# Altium schematic sheet Battery Circuit.SchDoc: STM32 LoRa Node
size A4; Author: Leon Baždar; CompanyName: FER; Address1: Zagreb; Revision: V1.0; SheetNumber: 3; SheetTotal: 6
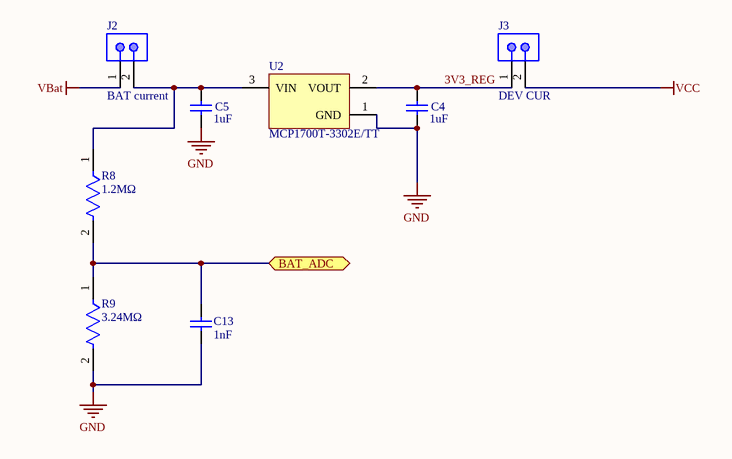
[diagram p0: Battery Circuit.SchDoc]

## Parts
C4  1uF  [CAPC2013X145X50LL20T25]
C5  1uF  [CAPC2013X145X50LL20T25]
C13  1nF  [CAPC1005X55X25LL05T05]
J2  BAT current  [TECO-5-146280-2_V]
J3  DEV CUR  [TECO-5-146280-2_V]
R8  1.2MΩ  [FP-CRCW0603-e3-IPC_A]
R9  3.24MΩ  [FP-CRCW0603-e3-MFG]
U2  MCP1700T-3302E/TT  [SOT-23-TT3_N]

## Ports
BAT_ADC (bidir)

## Nets
GND: C4.2 C5.2 C13.1 R9.2 U2.1(GND)
VBat: J2.1
VCC: J3.2
3V3_REG: C4.1 J3.1 U2.2(VOUT)
BAT_ADC: C13.2 R8.2 R9.1 ; port BAT_ADC
NetC5_1: C5.1 J2.2 R8.1 U2.3(VIN)

## Notes on the sheet
- Project:
- File:
- Size:
- A4
- Author:
- Revision:
- Date:
- Sheet
- of

## Library data of the parts
C4 C5 = CMP-2007-01016-1: Manufacturer: Kemet; Part Number: C0805C105K4PACTU
C13 = CMP-2008-01229-1: Manufacturer: Vitramon; Part Number: VJ0402Y102KXXCW1BC
J2 J3 = CMP-2000-07492-1: Male Header, Pitch 2.54 mm, 1 x 2 Position, Height 8.21 mm, Tail Length 3.05 mm, -65 to 105 degC, RoHS, Bulk; Manufacturer: TE Connectivity; Mating Connector Lock: No(Without); Number of Positions: 2; Pitch: 2.54mm; PCB Mounting Orientation: Vertical; Keyed: No; Case\/Package: 100; Mating Post Length: 0.23inch; High Temperature Housing: Yes; Max Current Rating: 5A; PCB Thickness: 0.063inch; PCB Mount Retention: Without; Approvals: CSA; Current Rating: 3A; Radiation Hardening: No; Length: 4.67mm; Contact Mating Length: 0.23inch; Connector Type: Header; Number of Rows: 1; Termination Post Length: 0.12inch; Board Standoff: No(Without); Max Operating Temperature: 105degC; Contact Shape: Square; Selectively Loaded: No(Without); Gasket: No(Without); Number of Contacts: 2; Contact Gender: Male; Mating Alignment: No(Without); Manufacturer URL: http://www.te.com/; Datasheet URL: http://www.te.com/commerce/DocumentDelivery/DDEController?Action=showdoc&DocId=Customer+Drawing%7F146280%7FH1%7Fpdf%7FEnglish%7FENG_CD_146280_H1.pdf%7F5-146280-2; Mount: ThroughHole; Orientation: Straight; Packaging: Carton; Package Reference: 5-146280-2; Package Quantity: 500; Stabilizers: No(Without); Row Spacing: 2.54mm; Contact Material: CopperAlloy; Panel Mount Retention: No(Without); Datasheet Version: Rev. H1, 08/2016; Housing Colour: Black; Colour: Black; Package Description: Male Header, Pitch 2.54 mm, 1 x 2 Position, Height 8.21 mm, Tail Length 3.05 mm; Contact Plating: Matte; Housing Material: Polymer; Contact Protection: No(Without); Min Operating Temperature: -65degC; Mounting Technology: ThroughHole; Flammability Rating: UL94V-0; RoHSCompliant: true; Termination: ThroughHole; Depth: 2.34mm; High Speed Serial Data Connector: No
R8 = CMP-2000-03023-2: RES Thick Film, 1.2MΩ, 1%, 0.1W, 100ppm/°C, 0603; Resistance: 1.2MR; Voltage Rating: 75V; Power Rating: 100mW; Weight: 7.1E-05oz; Tolerance: 1%; Lead Free: Lead Free; Contact Plating: Tin; Height: 0.45mm; Number of Terminations: 2; Depth: 0.85mm; Temperature Coefficient: 100ppm/°C; Voltage Rating (DC): 75V; Package Quantity: 10; Termination: SMD/SMT; Case Code (Metric): 1608; Width: 0.033inch; Radiation Hardening: No; Min Operating Temperature: -55°C; Military Standard: Not; Packaging: Tape and Reel; Number of Pins: 2; Features: Automotive AEC-Q200; Case/Package: 0603; Case Code (Imperial): 0603; Max Power Dissipation: 100mW; Composition: Thick Film; Max Operating Temperature: 155°C; Length: 1.55mm
R9 = CMP-2000-03317-2: RES Thick Film, 3.24MΩ, 1%, 0.1W, 100ppm/°C, 0603; Max Power Dissipation: 100mW; Voltage Rating (DC): 75V; Resistance: 3.24MR; Radiation Hardening: No; Features: Automotive AEC-Q200; Composition: Thick Film; Case Code (Imperial): 0603; Tolerance: 1%; Case Code (Metric): 1608; Height: 0.02inch; Length: 1.55mm; Temperature Coefficient: 100ppm/°C; Package Quantity: 10; Max Operating Temperature: 155°C; Lead Free: Lead Free; Military Standard: Not; Packaging: Tape and Reel; Width: 0.033inch; Weight: 7.1E-05oz; Voltage Rating: 75V; Power Rating: 100mW; Number of Terminations: 2; Min Operating Temperature: -55°C; Case/Package: 0603; Contact Plating: Tin; Depth: 0.85mm
U2 = CMP-0136-00791-1: Low Quiescent Current LDO, 3-Pin SOT-23, Extended Temperature, Tape and Reel; PackageVersion: revBB, Aug-2009; Code_IPC: SOT23-3; PackageReference: SOT-23-TT3; DatasheetVersion: revB, Feb-2007; PackageDescription: 3-Lead Plastic Small Outline Transistor (TT) [SOT-23]